# EAGLE design minisc (EAGLE 7.3.0)
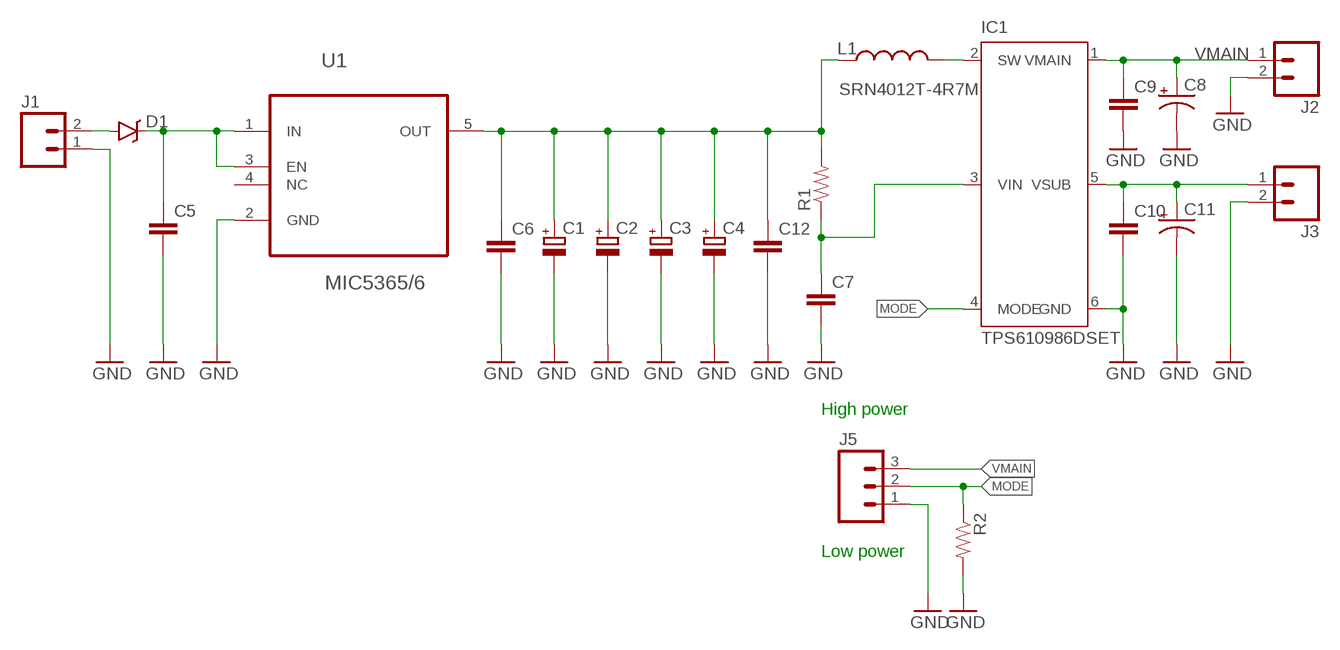
[diagram p0: schematic, sheet 1]

## Parts
C1  CPOL-EUE3.5-8  [E3,5-8]
C2  CPOL-EUE3.5-8  [E3,5-8]
C3  CPOL-EUE3.5-8  [E3,5-8]
C4  CPOL-EUE3.5-8  [E3,5-8]
C5  CAP0805  [0805]
C6  CAP0805  [0805]
C7  CAP0805  [0805]
C8  CAP_POL3528-KIT  [EIA3528-KIT]
C9  CAP0805  [0805]
C10  CAP0805  [0805]
C11  CAP_POL3528-KIT  [EIA3528-KIT]
C12  CAP0805  [0805]
D1  DIODE-SCHOTTKY-BAT20J  [SOD-323]
IC1  TPS610986DSET  TPS610985DSET  [WSON-6]
J1  M02PTH  [1X02]
J2  M02PTH  [1X02]
J3  M02PTH  [1X02]
J5  M03PTH  [1X03]
L1  SRN4012T-4R7M  INDUCTORCR54-3.3UH  [CR54]
R1  RESISTOR0805-RES  [0805]
R2  RESISTOR0805-RES  [0805]
U1  MIC5365/6  [SC-70-5]

## Nets
GND: C1.- C2.- C3.- C4.- C5.2 C6.2 C7.2 C8.C(-) C9.2 C10.2 C11.C(-) C12.2 IC1.6(GND) J1.1 J2.2 J3.2 J5.1 R2.2 U1.2(GND)
MODE: IC1.4(MODE) J5.2 R2.1
N$1: C5.1 D1.C U1.1(IN) U1.3(EN)
N$3: C1.+ C2.+ C3.+ C4.+ C6.1 C12.1 L1.P$1 R1.2 U1.5(OUT)
N$4: IC1.2(SW) L1.P$2
N$5: C7.1 IC1.3(VIN) R1.1
N$7: C10.1 C11.A(+) IC1.5(VSUB) J3.1
N$8: D1.A J1.2
VMAIN: C8.A(+) C9.1 IC1.1(VMAIN) J2.1 J5.3
Unconnected: U1.4(NC)

## Notes on the sheet
- High power
- Low power

## Library data of the parts
C1-C4 = rcl:CPOL-EU: POLARIZED CAPACITOR, European symbol
C5-C7 C9 C10 C12 = SparkFun-Passives:CAP: Capacitor Standard 0603 ceramic capacitor, and 0.1" leaded capacitor.
C8 C11 = SparkFun-Capacitors:CAP_POL: Capacitor Polarized These are standard SMD and PTH capacitors. Normally 10uF, 47uF, and 100uF in electrolytic and tantalum varieties. Always verify the external diameter of the through hole cap, it varies with capacity, voltage, and manufacturer. The EIA devices should be standard.
D1 = SparkFun-DiscreteSemi:DIODE-SCHOTTKY: Schottky diodes in SFE's production catalog BAT20J 1A 23V 0.62Vf RB751 120mA 40V 0.37Vf PMEG4005EJ 0.5A 40V 0.42Vf MBRA140 1A 40V 0.5Vf B340A 3A 40V SMA; PROD_ID: DIO-11623; VALUE: BAT20J
IC1 = mojaknižnica:TPS610985DSET: Power Management IC, Current Synchronous Boost, Integrated LDO/Load Switch, 0.7V - 4.5V in, WSON-6
J1-J3 = SparkFun-Connectors:M02: Standard 2-pin 0.1" header. Use with - straight break away headers ( PRT-00116) - right angle break away headers (PRT-00553) - swiss pins (PRT-00743) - machine pins (PRT-00117) - female headers (PRT-00115) Molex polarized connector foot print use with: PRT-08233 with associated crimp pins and housings. 2.54_SCREWTERM for use with PRT-10571. 3.5mm Screw Terminal footprints for PRT-08084 5mm Screw Terminal footprints for use with PRT-08432
J5 = SparkFun-Connectors:M03: Header 3 Standard 3-pin 0.1" header. Use with straight break away headers (SKU : PRT-00116), right angle break away headers (PRT-00553), swiss pins (PRT-00743), machine pins (PRT-00117), and female headers (PRT-00115). Molex polarized connector foot print use with SKU : PRT-08232 with associated crimp pins and housings.
L1 = SparkFun-Passives:INDUCTOR: Inductors Basic Inductor/Choke - 0603 and 1206. Footprints are not proven and vary greatly between part numbers. INDUCTOR POWER 3.3UH 4.0A SMD 0.197" L x 0.197" W x 0.177" H (5.00mm x 5.00mm x 4.50mm); PROD_ID: NDUC-11157; VALUE: 3.3uH
R1 R2 = SparkFun-Passives:RESISTOR: Resistor Basic schematic elements and footprints for 0603, 1206, and PTH resistors.
U1 = mojaknižnica:MIC5365/6: 150mA Low-Noise LDO Regulator; MPN: MIC5365; PACKAGE: sc-70-5; SUPPLIER: MICREL SEMICONDUCTOR

## Board
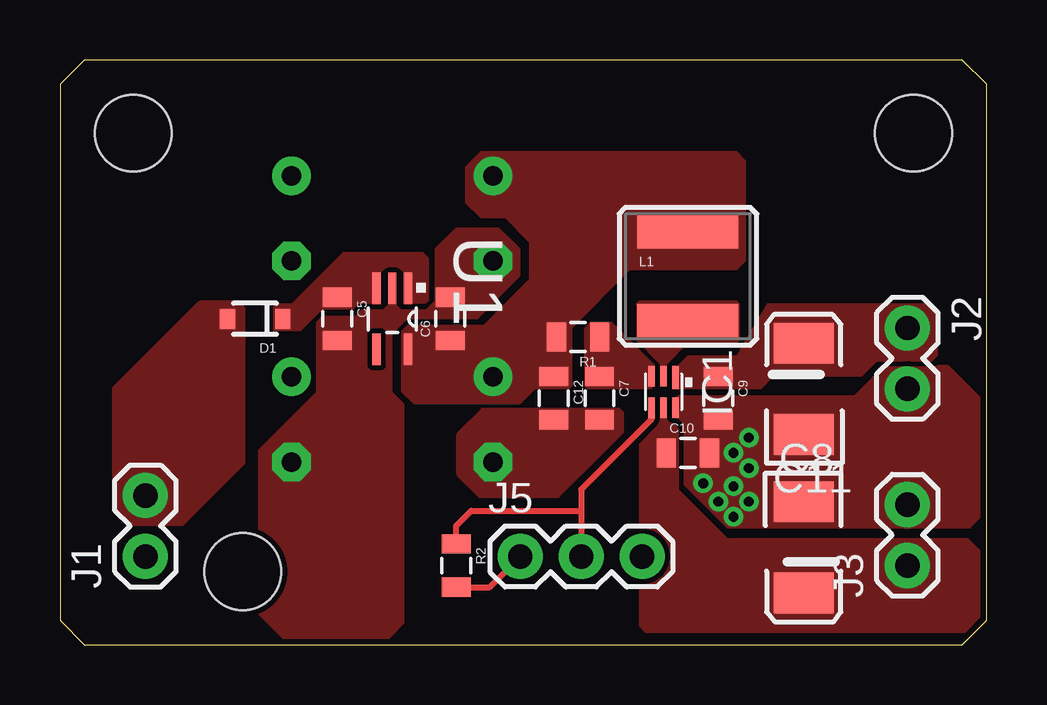
[diagram p1: board, top side]
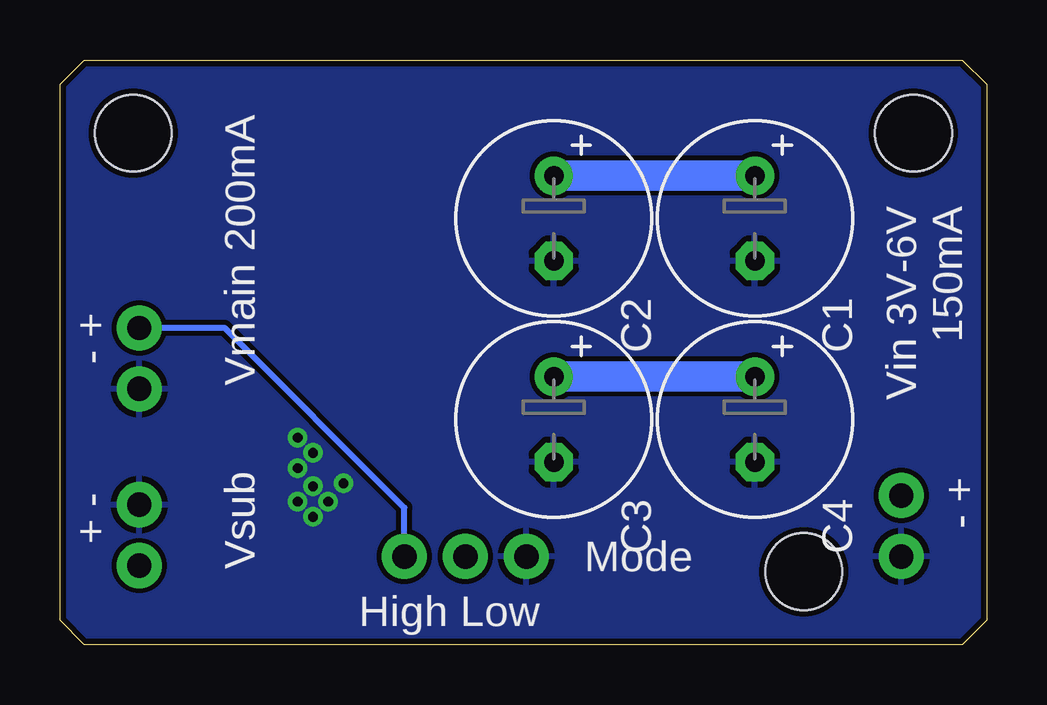
[diagram p2: board, bottom side, seen from below]

Size 38.61 x 24.38 mm. Coordinates in mm from the lower left corner, seen from the top.
Outline: 1.02,0 37.59,0 38.61,1.02 38.61,23.37 37.59,24.38 1.02,24.38 0,23.37 0,1.02 1.02,0
Copper layers (1*16): Top 0.035mm / dielectric 1.5mm / Bottom 0.035mm
Design rules "default *": minimum track width 10mil, minimum drill 24mil, track to track 8mil, track to pad 8mil, pad to pad 8mil, via to via 8mil, smd to smd 8mil, copper to edge 10mil, drill to drill 8mil, minimum pad ring 10mil, minimum via ring 8mil, stop-mask expansion 4mil, vias tented up to drill 20mil, thermal gap 10mil
Holes 3.2 mm at 7.62,3.05 3.05,21.34 35.56,21.34

### Footprints (pad centres in the part's own frame; a part is rotated, then mirrored left to right if it is on the bottom)
E3,5-8 = drill 0.813 pad 1.6: + -1.778,0 | drill 0.813 pad 1.6 octagon: - 1.778,0
0805 = smd 0.8 x 1.2: 1 -0.9,0; 2 0.9,0
EIA3528-KIT = smd 1.7 x 2.5: A 1.9,0; C -1.9,0
SOD-323 = smd 0.63 x 0.83: A 1.15,0; C -1.15,0
WSON-6 = smd 0.28 x 0.95: 1 -0.5,-0.6 | smd 0.28 x 0.85: 2 0,-0.65; 3 0.5,-0.65; 4 0.5,0.65; 5 0,0.65; 6 -0.5,0.65
1X02 = drill 1.016 pad 1.88: 1 0,0; 2 2.54,0
1X03 = drill 1.016 pad 1.88: 1 0,0; 2 2.54,0; 3 5.08,0
CR54 = smd 4.2 x 1.4: P$1 0,1.85; P$2 0,-1.85
SC-70-5 = smd 1.321 x 0.35: 1 -1.27,0.65; 2 -1.27,0; 3 -1.27,-0.65; 4 1.27,-0.65; 5 1.27,0.65

### Placement (x,y rotation side)
C1  9.65,17.78 270 bottom
C2  18.03,17.78 270 bottom
C3  18.03,9.4 270 bottom
C4  9.65,9.4 270 bottom
C5  11.56,13.59 270 top
C6  16.26,13.59 90 top
C7  22.48,10.29 270 top
C8  30.99,10.67 90 top
C9  27.43,10.29 270 top
C10  26.16,8 0 top
C11  30.99,4.06 270 top
C12  20.57,10.29 270 top
D1  8.13,13.59 180 top
IC1  25.15,10.54 180 top
J1  3.56,3.68 90 top
J2  35.31,13.21 270 top
J3  35.31,3.3 90 top
J5  19.18,3.68 0 top
L1  26.16,15.37 0 top
R1  21.59,12.83 180 top
R2  16.51,3.3 270 top
U1  13.84,13.59 270 top

### Tracks (layer width: path | path; a pad name or v marks a point on that pad's centre or on a via)
GND  (via drill 0.41)
  Top 0.254: R2.2 17.9,2.4 J5.1
  other vias: 28.7,8.64 28.07,8 26.8,6.73 28.7,7.37 28.07,6.6 27.43,5.97 28.7,5.97 28.07,5.33
  pour Bottom (rank 6): 0,0 38.61,0 38.61,24.38 0,24.38
  pour Top (rank 6, no thermals): 25.78,10.29 33.15,10.29 34.42,11.56 36.96,11.56 38.23,10.29 38.23,5.33 37.85,4.95 27.81,4.95 25.78,6.99
  pour Top (no thermals): 19.81,9.78 23.24,9.78 23.37,9.65 23.37,8.89 20.7,6.22 17.53,6.22 16.64,7.11 16.64,8.76 17.65,9.78
  pour Top (no thermals): 10.92,13.72 10.67,13.46 10.67,10.54 8.26,8.13 8.26,1.27 9.27,0.25 13.72,0.25 14.35,0.89 14.35,10.03 13.84,10.54 13.84,12.95 14.48,13.59 17.4,13.59 19.18,15.37 19.18,16.51 18.29,17.4 16.51,17.4 15.62,16.51 15.62,14.35 15.24,13.97 14.22,13.97 13.97,14.22 13.72,14.22 13.46,13.97 12.57,13.97 12.32,13.72
MODE
  Top 0.254: IC1.4 24.65,9.41 21.72,6.48 21.72,5.59 | 21.72,5.59 J5.2 | R2.1 16.51,4.95 17.14,5.59 21.72,5.59
N$1
  pour Top (no thermals): 8.89,13.08 10.03,13.08 10.92,13.97 12.19,13.97 12.45,14.22 13.34,14.22 13.34,15.49 13.46,15.62 14.22,15.62 14.35,15.49 14.35,14.22 15.24,14.22 15.37,14.35 15.37,16.13 15.11,16.38 11.81,16.38 9.65,14.22 8.89,14.22
N$3
  Bottom 1.27: C1.+ C2.+ | C4.+ C3.+
  pour Top (no thermals): 14.22,13.08 14.22,10.54 14.73,10.03 19.18,10.03 19.81,10.67 21.21,10.67 21.34,10.79 21.34,13.21 23.75,15.62 28.19,15.62 28.57,16 28.57,20.19 28.19,20.57 17.53,20.57 16.89,19.94 16.89,18.41 17.53,17.78 18.54,17.78 19.56,16.76 19.56,15.24 17.65,13.34 14.48,13.34
N$4
  pour Top (no thermals): 25.02,11.56 25.02,11.68 24,12.7 24,14.22 24.13,14.35 28.19,14.35 28.32,14.22 28.32,12.7 28.19,12.57 26.16,12.57 25.27,11.68 25.27,11.56
N$5
  pour Top (no thermals): 21.84,13.21 21.84,10.79 21.97,10.67 24.64,10.67 24.77,10.79 24.77,11.68 22.99,13.46 22.1,13.46
N$7
  pour Top (no thermals): 25.02,9.53 24.89,9.4 24.89,9.14 24.13,8.38 24.13,0.76 24.38,0.51 37.72,0.51 38.35,1.14 38.35,3.94 37.85,4.45 27.81,4.45 25.78,6.48 25.78,9.02 25.27,9.53
N$8
  pour Top (no thermals): 2.29,5.71 2.92,5.08 5.08,5.08 7.37,7.37 7.62,7.62 7.62,13.97 7.37,14.22 5.84,14.22 2.41,10.79 2.29,10.67
VMAIN
  Bottom 0.254: J5.3 24.26,5.71 31.75,13.21 J2.1
  pour Top (no thermals): 25.78,10.67 29.21,10.67 29.72,11.18 33.4,11.18 34.04,11.81 36.32,11.81 36.58,12.06 36.58,13.84 36.2,14.22 29.46,14.22 28.19,12.06 26.16,12.06 25.78,11.68

### Text on the board
bPlace: Vmain 200mA | Vin 3V-6V / 150mA | - + | - + | Vsub | + - | Mode | High Low